# EAGLE design pressure (EAGLE 5.11)
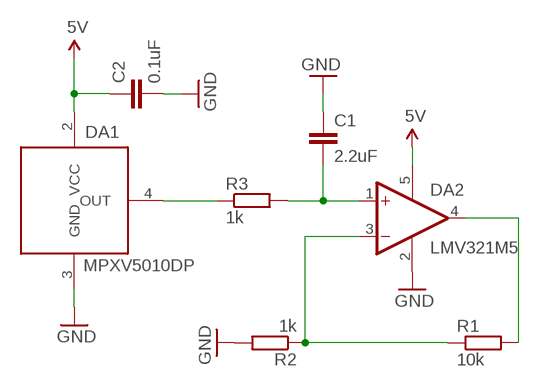
[diagram p0: schematic, sheet 1]

## Parts
C1  2.2uF  C-EUC1206  [C1206]
C2  0.1uF  C-EUC0805  [C0805]
DA1  MPXV5010DP  [482]
DA2  LMV321M5  [SOT23-5]
R1  10k  R-EU_R0805  [R0805]
R2  1k  R-EU_R0805  [R0805]
R3  1k  R-EU_R0805  [R0805]

## Nets
5V: C2.1 DA1.2(VCC) DA2.5(V+)
GND: C1.1 C2.2 DA1.3(GND) DA2.2(V-) R2.2
N$1: C1.2 DA2.1(+IN) R3.2
N$2: DA2.3(-IN) R1.1 R2.1
N$3: DA1.4(OUT) R3.1
N$4: DA2.4(OUT) R1.2

## Library data of the parts
C1 C2 = rcl:C-EU: CAPACITOR, European symbol
DA1 = barthess:MPXV5010DP
DA2 = linear:LMV321?*: General Purpose, Low Voltage, Rail-to-Rail Output Operational Amplifiers Source: http://www.national.com/mpf/LM/LMV321.html http://www.national.com/dt/lmv_qual.pdf
R1-R3 = rcl:R-EU_: RESISTOR, European symbol

## Board
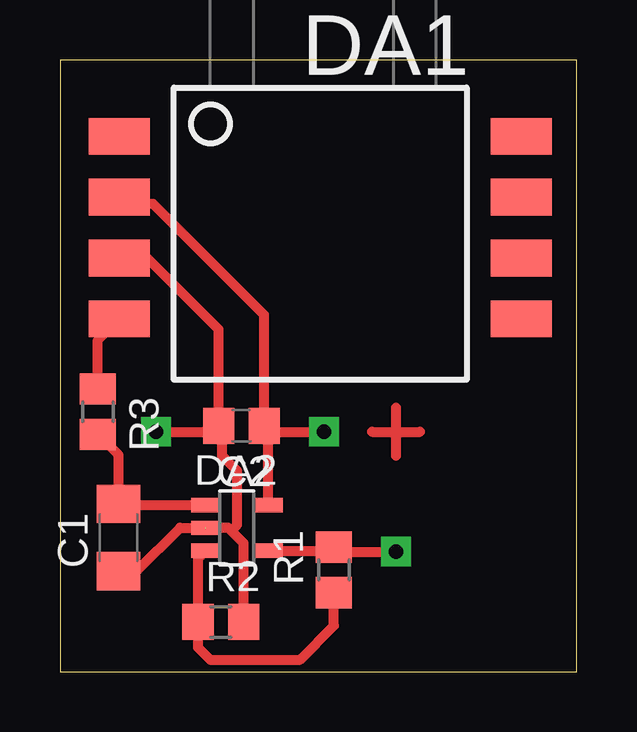
[diagram p1: board, top side]

Size 21.54 x 25.5 mm. Coordinates in mm from the lower left corner, seen from the top.
Outline: 0,0 21.54,0 21.54,25.5 0,25.5 0,0
Copper layers (1*16): Top 0.035mm / dielectric 1.5mm / Bottom 0.035mm
Design rules "default": minimum track width 12mil, minimum drill 32mil, track to track 12mil, track to pad 12mil, pad to pad 12mil, via to via 12mil, smd to smd 8mil, copper to edge 1mm, drill to drill 40mil, minimum pad ring 12mil, minimum via ring 12mil, stop-mask expansion 4mil, vias tented up to drill 0mil, thermal gap 10mil

### Footprints (pad centres in the part's own frame; a part is rotated, then mirrored left to right if it is on the bottom)
C1206 = smd 1.6 x 1.8: 1 -1.4,0; 2 1.4,0
C0805 = smd 1.3 x 1.5: 1 -0.95,0; 2 0.95,0
482 = smd 2.54 x 1.524: 1 -7.62,3.81; 2 -7.62,1.27; 3 -7.62,-1.27; 4 -7.62,-3.81; 5 9.144,-3.81; 6 9.144,-1.27; 7 9.144,1.27; 8 9.144,3.81
SOT23-5 = smd 0.6 x 1.2: 1 -0.95,-1.306; 2 0,-1.306; 3 0.95,-1.306; 4 0.95,1.306; 5 -0.95,1.306
R0805 = smd 1.3 x 1.5: 1 -0.95,0; 2 0.95,0

### Placement (x,y rotation side)
C1  2.44,5.59 90 top
C2  7.56,10.25 180 top
DA1  10.08,18.51 0 top
DA2  7.37,5.99 270 top
R1  11.41,4.24 90 top
R2  6.7,2.07 0 top
R3  1.58,10.84 270 top

### Tracks (layer width: path | path; a pad name or v marks a point on that pad's centre or on a via)
5V
  Top 0.406: DA1.2 2.74,19.5 3.88,19.5 8.51,14.86 C2.1 8.68,10.08 DA2.5
GND  (1 unrouted)
  Top 0.406: DA1.3 3.62,17.25 6.61,14.27 C2.2 6.75,10.11 6.75,9 7.38,8.38 7.38,6.12 7.12,5.88 | C1.1 3.19,4.19 5,6 DA2.2 | R2.2 7.65,5.35 7.12,5.88 | 7.12,5.88 7,6 6.07,6 DA2.2
N$1
  Top 0.406: DA2.1 2.49,6.94 C1.2 2.44,9.02 R3.2
N$2
  Top 0.406: DA2.3 5.75,4.73 R2.1 5.75,1 6.25,0.5 10,0.5 11.41,1.91 R1.1
N$3
  Top 0.406: R3.1 1.58,13.82 DA1.4
N$4
  Top 0.406: DA2.4 11.26,5.04 R1.2
N$5  (via drill 0.6)
  Top 0.406: 12,5 v14,5
N$6  (via drill 0.6)
  Top 0.406: 9,10 v11,10
N$7  (via drill 0.6)
  Top 0.406: v4,10 6,10
N$8
  Top 0.406: 14,9 14,11
N$9
  Top 0.406: 13,10 15,10